# Altium project pdb-25.PrjPcb (part 2 of 3)

## Sheet 18V_Buck.SchDoc
size 259 x 167 mm; SheetNumber: 6; SheetTotal: 15
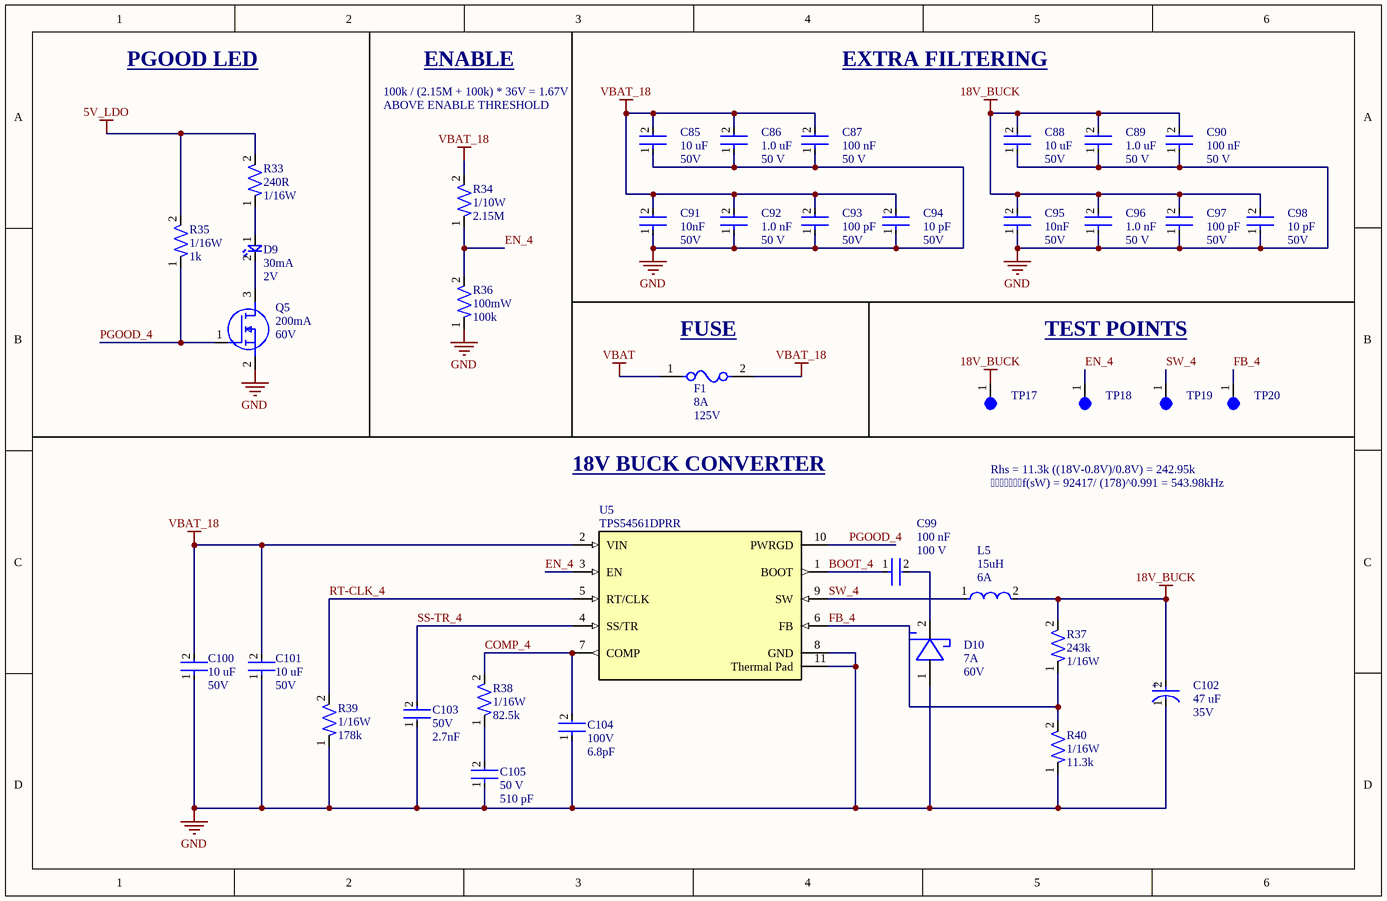
[diagram p5: 18V_Buck.SchDoc]

### Parts
(Parts that share a designator on the sheet are numbered #1, #2 ... from top to bottom, then left to right.)
C85  Voltage: 50V  Capacitance: 10 uF  [CAP-1210]  (hidden comment: CL32B106KBJNNNE)
C86  Voltage: 50 V  Capacitance: 1.0 uF  [CAP-0805]  (hidden comment: CC0805KKX7R9BB105)
C87  Voltage Rating: 50 V  Capacitance: 100 nF  [CAP-0805]  (hidden comment: CC0805KRX7R9BB104)
C88  Voltage: 50V  Capacitance: 10 uF  [CAP-1210]  (hidden comment: CL32B106KBJNNNE)
C89  Voltage: 50 V  Capacitance: 1.0 uF  [CAP-0805]  (hidden comment: CC0805KKX7R9BB105)
C90  Voltage Rating: 50 V  Capacitance: 100 nF  [CAP-0805]  (hidden comment: CC0805KRX7R9BB104)
C91  Voltage: 50V  Capacitance: 10nF  [CAP-0805]  (hidden comment: GRM2195C1H103JA01D)
C92  Voltage: 50 V  Capacitance: 1.0 nF  [CAP-0402]  (hidden comment: CC0402KRX7R9BB102)
C93  Capacitance: 100 pF  Voltage: 50V  [CAP-0402]  (hidden comment: CC0402JRNPO9BN101)
C94  Capacitance: 10 pF  Voltage: 50V  [CAP-0402]  (hidden comment: CC0402JRNPO9BN100)
C95  Voltage: 50V  Capacitance: 10nF  [CAP-0805]  (hidden comment: GRM2195C1H103JA01D)
C96  Voltage: 50 V  Capacitance: 1.0 nF  [CAP-0402]  (hidden comment: CC0402KRX7R9BB102)
C97  Capacitance: 100 pF  Voltage: 50V  [CAP-0402]  (hidden comment: CC0402JRNPO9BN101)
C98  Capacitance: 10 pF  Voltage: 50V  [CAP-0402]  (hidden comment: CC0402JRNPO9BN100)
C99  Capacitance: 100 nF  Voltage: 100 V  [CAP-0603]  (hidden comment: CC0603KRX7R0BB104)
C100  Voltage: 50V  Capacitance: 10 uF  [CAP-1210]  (hidden comment: CL32B106KBJNNNE)
C101  Voltage: 50V  Capacitance: 10 uF  [CAP-1210]  (hidden comment: CL32B106KBJNNNE)
C102  Voltage: 35V  Capacitance: 47 uF  [CAP_EEHZC1V470P]  (hidden comment: EEH-ZC1V470P)
C103  Voltage: 50V  Capacitance: 2.7nF  [CAP-0805]  (hidden comment: GRM2165C1H272JA01D)
C104  Voltage: 100V  Capacitance: 6.8pF  [CAP-0603]  (hidden comment: CC0603CRNPO0BN6R8)
C105  Voltage: 50 V  Capacitance: 510 pF  [CAP-0402]  (hidden comment: 0402N511J500CT)
D9  Forward Current: 30mA  Forward Voltage: 2V  [LED-0603]  (hidden comment: BL-HKC36G-AV-TRB)
D10  Forward Current: 7A  Reverse Voltage (DC): 60V  [DO-POWERDI5]  (hidden comment: PDS760-13)
F1#2  Fuse Current: 8A  Voltage Rating: 125V  [FUSE-0001]  (hidden comment: 01550900M)
L5  Inductance: 15uH  Current Rating: 6A  [IND-15U-0002]  (hidden comment: CSAD1010-150M)
Q5  Continuous Current: 200mA  Voltage: 60V  [IC-SOT23-3]  (hidden comment: T2N7002AK,LM)
R33  Resistance: 240R  Power: 1/16W  [RES-0402]  (hidden comment: RC0402FR-07240RL)
R34  Power: 1/10W  Resistance: 2.15M  [RES-0603]  (hidden comment: RC0603FR-072M15L)
R35  Power: 1/16W  Resistance: 1k  [RES-0402]  (hidden comment: RC0402FR-071KL)
R36  Power: 100mW  Resistance: 100k  [RES-0603]  (hidden comment: RC0603FR-07100KL)
R37  Resistance: 243k  Power: 1/16W  [RES-0402]  (hidden comment: RC0402FR-07243KL)
R38  Power: 1/16W  Resistance: 82.5k  [RES-0402]  (hidden comment: RC0402FR-0782K5L)
R39  Power: 1/16W  Resistance: 178k  [RES-0402]  (hidden comment: RTT021783FTH)
R40  Power: 1/16W  Resistance: 11.3k  [RES-0402]  (hidden comment: RC0402FR-0711K3L)
TP17  5003  [TEST-POINT-0001]  (value not drawn)
TP18  5003  [TEST-POINT-0001]  (value not drawn)
TP19  5003  [TEST-POINT-0001]  (value not drawn)
TP20  5003  [TEST-POINT-0001]  (value not drawn)
U5  TPS54561DPRR  [IC-10WSON]

### Nets
5V_LDO: R33.2 R35.2
18V_BUCK: C88.2 C89.2 C90.2 C95.2 C96.2 C97.2 C98.2 C102.2(A) L5.2 R37.2 TP17.1
GND: C85.1 C86.1 C87.1 C88.1 C89.1 C90.1 C91.1 C92.1 C93.1 C94.1 C95.1 C96.1 C97.1 C98.1 C100.1 C101.1 C102.1(C) C103.1 C104.1 C105.1 D10.1(CATHODE) Q5.2(S) R36.1 R39.1 R40.1 U5.8(GND) U5.11(Thermal_Pad)
VBAT: F1#2.1
VBAT_18: C85.2 C86.2 C87.2 C91.2 C92.2 C93.2 C94.2 C100.2 C101.2 F1#2.2 R34.2 U5.2(VIN)
BOOT_4: C99.1 U5.1(BOOT)
COMP_4: C104.2 R38.2 U5.7(COMP)
EN_4: R34.1 R36.2 TP18.1 U5.3(EN)
FB_4: R37.1 R40.2 TP20.1 U5.6(FB)
PGOOD_4: Q5.1(G) R35.1 U5.10(PWRGD)
RT-CLK_4: R39.2 U5.5(RT/CLK)
SS-TR_4: C103.2 U5.4(SS/TR)
SW_4: L5.1 TP19.1 U5.9(SW)
NetC99_2: C99.2 D10.2(ANODE)
NetC105_2: C105.2 R38.1
NetD9_1: D9.1 R33.1
NetD9_2: D9.2 Q5.3(D)

### Notes on the sheet
- PGOOD LED
- 100k / (2.15M + 100k) * 36V = 1.67V
- ABOVE ENABLE THRESHOLD
- ENABLE
- EXTRA FILTERING
- (near F1#2) FUSE
- TEST POINTS
- 18V BUCK CONVERTER
- Rhs = 11.3k ((18V-0.8V)/0.8V) = 242.95k
- f(sW) = 92417/ (178)^0.991 = 543.98kHz
- (in symbol CAP-47U-0003) +

### Library data of the parts
C85 C88 C100 C101 = CAP-10U-0002: CAP CER 10UF 50V X7R 1210; Device Class: Ceramic; Size: 1210; ComponentLink1Description: Datasheet; ComponentLink1URL: https://mm.digikey.com/Volume0/opasdata/d220001/medias/docus/41/CL32B106KBJNNNE_Spec.pdf
C86 C89 = CAP-1U-0001: CAP CER 1UF 50V X7R 0805; ComponentLink2URL: https://www.yageo.com/upload/media/product/productsearch/datasheet/mlcc/UPY-GPHC_X7R_6.3V-to-250V_24.pdf; ComponentLink2Description: Datasheet; Device Class: Ceramic; Size: 0805
C87 C90 = CAP-0.1U-0002: CAP CER 0.1UF 50V X7R 0805; ComponentLink2Description: Datasheet; ComponentLink2URL: https://www.yageo.com/upload/media/product/productsearch/datasheet/mlcc/UPY-GPHC_X7R_6.3V-to-250V_24.pdf; Device Class: Ceramic; Size: 0805
C91 C95 = CAP-10N-0001: CAP CER 10000PF 50V C0G/NP0 0805; Device Class: Ceramic; Size: 0805; ComponentLink1Description: Datasheet; ComponentLink1URL: https://search.murata.co.jp/Ceramy/image/img/A01X/G101/ENG/GRM2195C1H103JA01-01.pdf
C92 C96 = CAP-1N-0001: CAP CER 1000PF 50V X7R 0402; ComponentLink2Description: Datasheet; ComponentLink2URL: http://www.yageo.com/documents/recent/UPY-GP_NP0_16V-to-50V_16.pdf; Device Class: Ceramic; Size: 0402
C93 C97 = CAP-100P-0001: CAP CER 100PF 50V C0G/NPO 0402; Device Class: Ceramic; Size: 0402; ComponentLink1Description: Datasheet; ComponentLink1URL: https://www.yageo.com/upload/media/product/productsearch/datasheet/mlcc/UPY-GP_NP0_16V-to-50V_18.pdf
C94 C98 = CAP-10P-0001: CAP CER 10PF 50V C0G/NPO 0402; Device Class: Ceramic; Size: 0402; ComponentLink1Description: Datasheet; ComponentLink1URL: https://www.yageo.com/upload/media/product/productsearch/datasheet/mlcc/UPY-GP_NP0_16V-to-50V_18.pdf
C99 = CAP-100N-0001: CAP CER 0.1UF 100V X7R 0603; Device Class: Ceramic; Size: 0603; ComponentLink1Description: Datasheet; ComponentLink1URL: https://www.yageo.com/upload/media/product/app/datasheet/mlcc/upy-np0x7r_mv_100-to-630v.pdf
C102 = CAP-47U-0003: 47 µF 35 V Aluminum - Polymer Capacitors Radial, Can - SMD 60mOhm 4000 Hrs @ 125°C; Device Class: Electrolytic
C103 = CAP-2.7N-0001: CAP CER 2700PF 50V C0G/NP0 0805; ComponentLink1Description: Datasheet; ComponentLink1URL: https://search.murata.co.jp/Ceramy/image/img/A01X/G101/ENG/GRM2165C1H272JA01-01.pdf; Device Class: Ceramic; Size: 0805
C104 = CAP-6.8P-0001: CAP CER 6.8PF 100V C0G/NPO 0603; Device Class: Ceramic; ComponentLink1Description: Datasheet; ComponentLink1URL: https://www.yageo.com/upload/media/product/productsearch/datasheet/mlcc/UPY-GPHC_X7R_6.3V-to-250V_24.pdf; Size: 0603
C105 = CAP-510P-0001: CAP CER 510PF 50V C0G/NP0 0402; ComponentLink2Description: Datasheet; ComponentLink2URL: https://www.mouser.com/ProductDetail/Walsin/0402N511J500CT?qs=u16ybLDytRbq33ukPPRl4A%3D%3D&srsltid=AfmBOoq1-HCbTRqPV3GtwyI6lHLBf095DSA3Qg1Qkiix4a-obr82TmJ6; Device Class: Ceramic; Size: 0402
D9 = LED-0001: LED YELLOW CLEAR 0603 SMD; ComponentLink1Description: Datasheet; ComponentLink1URL: https://www.americanbrightled.com/pdffiles/led-components/smt/BL-HKC36G-AV-TRB.pdf
D10 = DIO-SCHOTTKY-0001: DIODE SCHOTTKY 60V 7A POWERDI5; ComponentLink1Description: Datasheet; ComponentLink1URL: https://www.diodes.com/assets/Datasheets/PDS760.pdf
F1#2 = FUSE-0001: FUSE BLOK CARTRIDGE 125V 10A SMD; ComponentLink2Description: Datasheet; ComponentLink2URL: https://www.littelfuse.com/~/media/electronics/datasheets/fuses/littelfuse_fuse_154_154t_154l_154tl_datasheet.pdf.pdf
L5 = IND-15U-0002-NoJLC: SMD MOLDING POWER CHOKE; ComponentLink1Description: Datasheet; ComponentLink1URL: https://www.digikey.com/en/products/detail/codaca/CSAD1010-150M/16633512?s=N4IgjCBcoBwAxVAYygMwIYBsDOBTANCAPZQDaIALHAExwDMEAuoQA4AuUIAymwE4CWAOwDmIAL6Ew1MAE5EIFJAw4CxMiGoy6AdmoUQhajGqa6BjTDp6zhywFY4c23UtOLFbVXPVtYK3e9dODsbdwA2OxgQZhB2Th4BEXFJTQhoBTQsPEISSHITS0do1g5Ibj4hUQkNOBhteTiygFVBfjYAeVQAWVx0bABXXlxzfs4AVoAJcwBbIU4wAMJp9AAPeYDq2hgo9MaQFrbOnr7B4cJRsoBBGbmyuwA6DcIAWmp5RT5%2B1VzyAMYxAFAA
Q5 = NMOS-200MA-0001: MOSFET N-CH 60V 200MA SOT23; ComponentLink1Description: Datasheet; ComponentLink1URL: https://toshiba.semicon-storage.com/info/T2N7002AK_datasheet_en_20150401.pdf?did=29712&prodName=T2N7002AK
R33 = RES-240-0001: 240R 0.063W 1% 0402 (1005 Metric)  SMD; Tolerance: 1%; Size: 0402; ComponentLink1Description: Datasheet; ComponentLink1URL: https://www.yageo.com/upload/media/product/products/datasheet/rchip/PYu-RC_Group_51_RoHS_L_12.pdf
R34 = RES-2.15M-0001: RES SMD 2.15M OHM 1% 1/10W 0603; Tolerance: 1%; Size: 0603; ComponentLink1Description: Datasheet; ComponentLink1URL: https://www.yageo.com/upload/media/product/products/datasheet/rchip/PYu-RC_Group_51_RoHS_L_12.pdf
R35 = RES-1k-0001: RES 1K OHM 1% 1/16W 0402; Tolerance: 1%; Size: 0402; ComponentLink1Description: Datasheet; ComponentLink1URL: https://www.yageo.com/upload/media/product/products/datasheet/rchip/PYu-RC_Group_51_RoHS_L_12.pdf
R36 = RES-100k-0001: RES SMD 100K OHM 1% 1/10W 0603; Tolerance: 1%; Size: 0603; ComponentLink1Description: Datasheet; ComponentLink1URL: https://www.yageo.com/upload/media/product/products/datasheet/rchip/PYu-RC_Group_51_RoHS_L_12.pdf
R37 = RES-243k-0001: 243 kOhms ±1% 0.063W, 1/16W Chip Resistor 0402 (1005 Metric) Moisture Resistant Thick Film; Tolerance: 1%; Size: 0402; ComponentLink1Description: Datasheet; ComponentLink1URL: https://www.yageo.com/upload/media/product/products/datasheet/rchip/PYu-RC_Group_51_RoHS_L_12.pdf
R38 = RES-82.5k-0001: 82.5 kOhms ±1% 0.063W, 1/16W Chip Resistor 0402 (1005 Metric) Moisture Resistant Thick Film; Tolerance: 1%; Size: 0603; ComponentLink1Description: Datasheet; ComponentLink1URL: https://www.lcsc.com/datasheet/lcsc_datasheet_2304140030_YAGEO-RC0603FR-0712KL_C114659.pdf
R39 = RES-178k-0001_1: 62.5mW Thick Film Resistors 50V ±100ppm/℃ ±1% 178kΩ 0402 Chip Resistor - Surface Mount ROHS; Tolerance: 1%; Size: 0402; ComponentLink1Description: Datasheet; ComponentLink1URL: https://www.lcsc.com/datasheet/lcsc_datasheet_2304140030_RALEC-RTT021783FTH_C102842.pdf
R40 = RES-11.3k-0001: 11.3 kOhms ±1% 0.063W, 1/16W Chip Resistor 0402 (1005 Metric) Moisture Resistant Thick Film; Tolerance: 1%; Size: 0603; ComponentLink1Description: Datasheet; ComponentLink1URL: https://www.yageo.com/upload/media/product/products/datasheet/rchip/PYu-RC_Group_51_RoHS_L_12.pdf
TP17-TP20 = TEST-POINT-0001: Oranange PC Test Point, Miniature Phoisphor Bronze Silver Plating Through Hole Mounting Type
U5 = IC-BUCK-0001: IC REG BUCK ADJ 5A 10WSON; ComponentLink1Description: Datasheet; ComponentLink1URL: https://www.ti.com/general/docs/suppproductinfo.tsp?distId=10&gotoUrl=https%3A%2F%2Fwww.ti.com%2Flit%2Fgpn%2Ftps54561

## Sheet 5V_Buck.SchDoc
size 259 x 167 mm; SheetNumber: 7; SheetTotal: 15
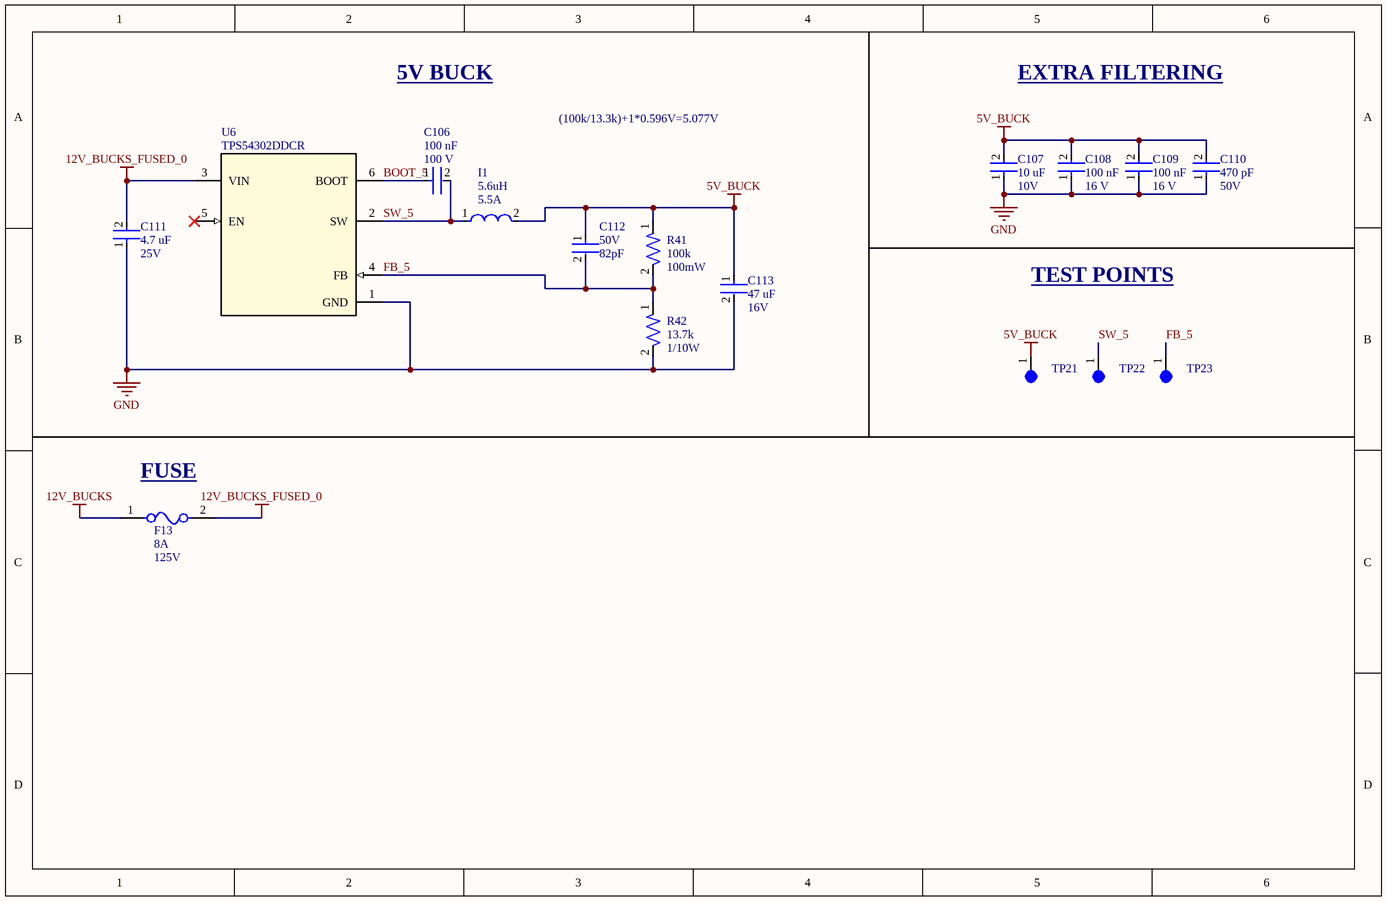
[diagram p6: 5V_Buck.SchDoc]

### Parts
C106  Capacitance: 100 nF  Voltage: 100 V  [CAP-0603]  (hidden comment: CC0603KRX7R0BB104)
C107  Voltage: 10V  Capacitance: 10 uF  [CAP-0603]  (hidden comment: CC0603KRX5R6BB106)
C108  Voltage Rating: 16 V  Capacitance: 100 nF  [CAP-0402]  (hidden comment: CC0402KRX7R7BB104)
C109  Voltage Rating: 16 V  Capacitance: 100 nF  [CAP-0402]  (hidden comment: CC0402KRX7R7BB104)
C110  Voltage: 50V  Capacitance: 470 pF  [CAP-0805]  (hidden comment: CC0805JRNPO9BN471)
C111  Capacitance: 4.7 uF  Voltage: 25V  [CAP-0603]  (hidden comment: CC0603KRX5R8BB475)
C112  Voltage: 50V  Capacitance: 82pF  [CAP-0805]  (hidden comment: CC0805JRNPO9BN820)
C113  Capacitance: 47 uF  Voltage: 16V  [CAP-1210]  (hidden comment: GRM32ER61C476KE15L)
F13  Fuse Current: 8A  Voltage Rating: 125V  [FUSE-0001]  (hidden comment: 01550900M)
I1  Saturation Current: 5.5A  Inductance: 5.6uH  [IND_SRP6540-5R6M]  (hidden comment: SRP6540-5R6M)
R41  Power: 100mW  Resistance: 100k  [RES-0603]  (hidden comment: RC0603FR-07100KL)
R42  Power: 1/10W  Resistance: 13.7k  [RES-0603]  (hidden comment: RC0603FR-0713K7L)
TP21  5003  [TEST-POINT-0001]  (value not drawn)
TP22  5003  [TEST-POINT-0001]  (value not drawn)
TP23  5003  [TEST-POINT-0001]  (value not drawn)
U6  TPS54302DDCR  [IC-SOT-23-6]

### Nets
5V_BUCK: C107.2 C108.2 C109.2 C110.2 C112.1 C113.1 I1.2 R41.1 TP21.1
12V_BUCKS: F13.1
12V_BUCKS_FUSED_0: C111.2 F13.2 U6.3(VIN)
GND: C107.1 C108.1 C109.1 C110.1 C111.1 C113.2 R42.2 U6.1(GND)
BOOT_5: C106.1 U6.6(BOOT)
FB_5: C112.2 R41.2 R42.1 TP23.1 U6.4(FB)
SW_5: C106.2 I1.1 TP22.1 U6.2(SW)

Not connected (* = marked no-connect by the designer): U6 5(EN)*

### Notes on the sheet
- 5V BUCK
- EXTRA FILTERING
- (100k/13.3k)+1*0.596V=5.077V
- TEST POINTS
- (near F13) FUSE

### Library data of the parts
C106 = CAP-100N-0001: CAP CER 0.1UF 100V X7R 0603; Device Class: Ceramic; Size: 0603; ComponentLink1Description: Datasheet; ComponentLink1URL: https://www.yageo.com/upload/media/product/app/datasheet/mlcc/upy-np0x7r_mv_100-to-630v.pdf
C107 = CAP-10U-0001: CAP CER 10UF 10V X5R 0603; ComponentLink1Description: Datasheet; ComponentLink1URL: https://www.yageo.com/upload/media/product/app/datasheet/mlcc/upy-gphc_x5r_4v-to-50v.pdf; Device Class: Ceramic; Size: 0603
C108 C109 = CAP-0.1U-0001: CAP CER 0.1UF 16V X7R 0402; ComponentLink2Description: Datasheet; ComponentLink2URL: https://www.yageo.com/upload/media/product/productsearch/datasheet/mlcc/UPY-GPHC_X7R_6.3V-to-250V_24.pdf; Device Class: Ceramic; Size: 0402
C110 = CAP-470P-0001: CAP CER 470PF 50V C0G/NPO 0805; Device Class: Ceramic; Size: 0805; ComponentLink1Description: Datasheet; ComponentLink1URL: https://www.yageo.com/upload/media/product/productsearch/datasheet/mlcc/UPY-GP_NP0_16V-to-50V_18.pdf
C111 = CAP-4.7U-0001: CAP CER 4.7UF 25V X5R 0603; Device Class: Ceramic; Size: 0603
C112 = CAP-82P-0001: 82 pF ±5% 50V Ceramic Capacitor C0G, NP0 0805 (2012 Metric)
C113 = CAP-47U-0002: CAP CER 47UF 16V X5R 1210; Device Class: Ceramic; Size: 1210; ComponentLink1Description: Datasheet; ComponentLink1URL: https://search.murata.co.jp/Ceramy/image/img/A01X/G101/ENG/GRM32ER61C476KE15-01.pdf
F13 = FUSE-0001: FUSE BLOK CARTRIDGE 125V 10A SMD; ComponentLink2Description: Datasheet; ComponentLink2URL: https://www.littelfuse.com/~/media/electronics/datasheets/fuses/littelfuse_fuse_154_154t_154l_154tl_datasheet.pdf.pdf
I1 = IND-5.6U-0002: FIXED IND 5.6UH 5.5A 38 MOHM SMD
R41 = RES-100k-0001: RES SMD 100K OHM 1% 1/10W 0603; Tolerance: 1%; Size: 0603; ComponentLink1Description: Datasheet; ComponentLink1URL: https://www.yageo.com/upload/media/product/products/datasheet/rchip/PYu-RC_Group_51_RoHS_L_12.pdf
R42 = RES-13.7K-0001: RES 13.7K OHM 1% 1/10W 0603
TP21-TP23 = TEST-POINT-0001: as TP17 on sheet 18V_Buck
U6 = IC-BUCK-0004: IC REG BUCK ADJ 3A SOT23

## Sheet 12V_Buck_For_LDOs.SchDoc
size 259 x 167 mm; SheetNumber: 8; SheetTotal: 15
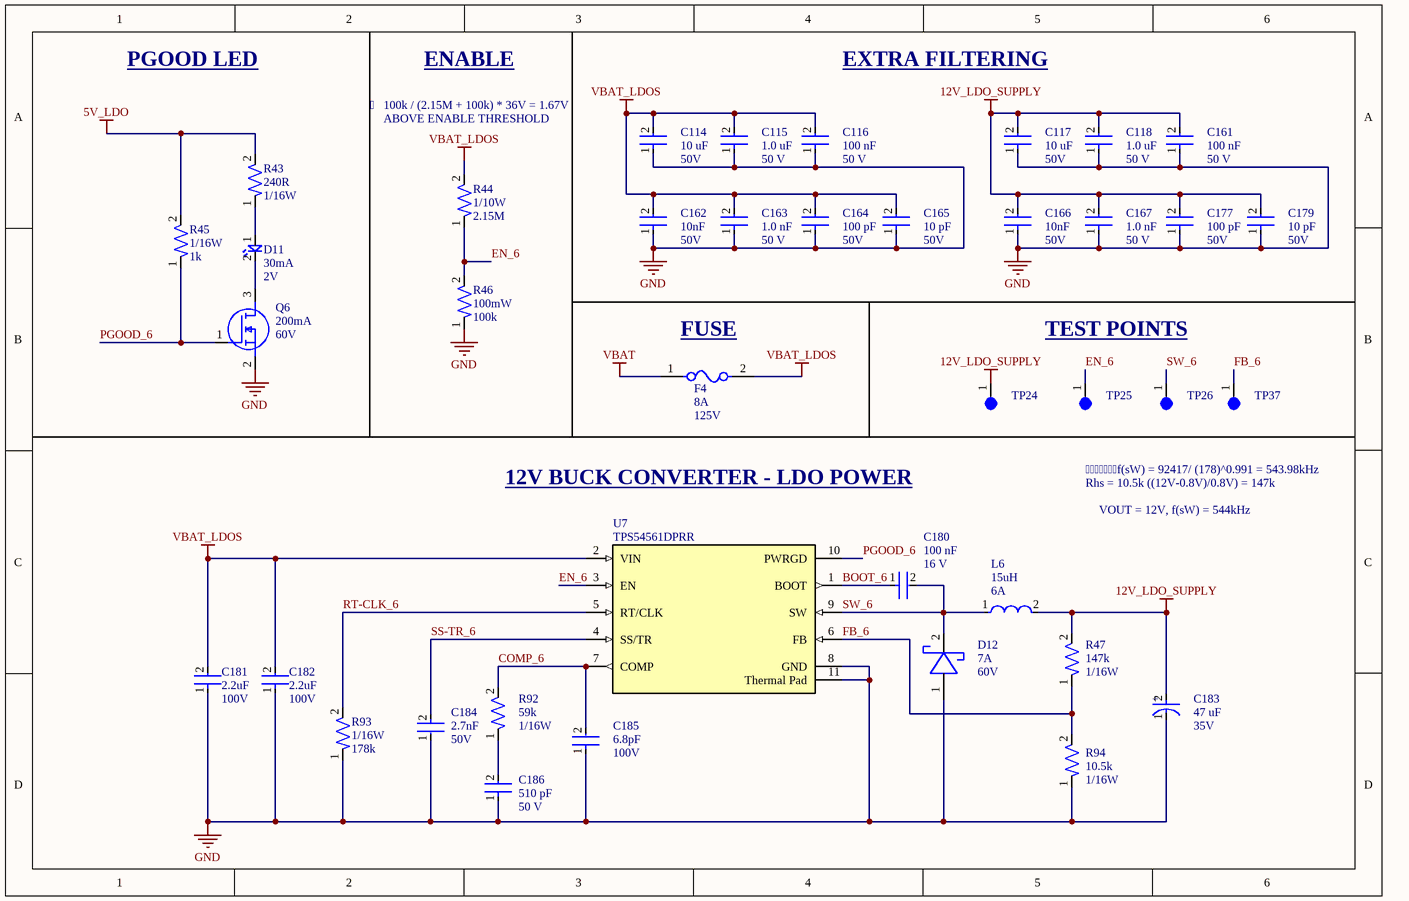
[diagram p7: 12V_Buck_For_LDOs.SchDoc]

### Parts
C114  Voltage: 50V  Capacitance: 10 uF  [CAP-1210]  (hidden comment: CL32B106KBJNNNE)
C115  Voltage: 50 V  Capacitance: 1.0 uF  [CAP-0805]  (hidden comment: CC0805KKX7R9BB105)
C116  Voltage Rating: 50 V  Capacitance: 100 nF  [CAP-0805]  (hidden comment: CC0805KRX7R9BB104)
C117  Voltage: 50V  Capacitance: 10 uF  [CAP-1210]  (hidden comment: CL32B106KBJNNNE)
C118  Voltage: 50 V  Capacitance: 1.0 uF  [CAP-0805]  (hidden comment: CC0805KKX7R9BB105)
C161  Voltage Rating: 50 V  Capacitance: 100 nF  [CAP-0805]  (hidden comment: CC0805KRX7R9BB104)
C162  Voltage: 50V  Capacitance: 10nF  [CAP-0805]  (hidden comment: GRM2195C1H103JA01D)
C163  Voltage: 50 V  Capacitance: 1.0 nF  [CAP-0402]  (hidden comment: CC0402KRX7R9BB102)
C164  Capacitance: 100 pF  Voltage: 50V  [CAP-0402]  (hidden comment: CC0402JRNPO9BN101)
C165  Capacitance: 10 pF  Voltage: 50V  [CAP-0402]  (hidden comment: CC0402JRNPO9BN100)
C166  Voltage: 50V  Capacitance: 10nF  [CAP-0805]  (hidden comment: GRM2195C1H103JA01D)
C167  Voltage: 50 V  Capacitance: 1.0 nF  [CAP-0402]  (hidden comment: CC0402KRX7R9BB102)
C177  Capacitance: 100 pF  Voltage: 50V  [CAP-0402]  (hidden comment: CC0402JRNPO9BN101)
C179  Capacitance: 10 pF  Voltage: 50V  [CAP-0402]  (hidden comment: CC0402JRNPO9BN100)
C180  Voltage Rating: 16 V  Capacitance: 100 nF  [CAP-0402]  (hidden comment: CC0402KRX7R7BB104)
C181  Capacitance: 2.2uF  Voltage: 100V  [CAP-1206]  (hidden comment: CC1206KKX7R0BB225)
C182  Capacitance: 2.2uF  Voltage: 100V  [CAP-1206]  (hidden comment: CC1206KKX7R0BB225)
C183  Voltage: 35V  Capacitance: 47 uF  [CAP_EEHZC1V470P]  (hidden comment: EEH-ZC1V470P)
C184  Voltage: 50V  Capacitance: 2.7nF  [CAP-0805]  (hidden comment: GRM2165C1H272JA01D)
C185  Voltage: 100V  Capacitance: 6.8pF  [CAP-0603]  (hidden comment: CC0603CRNPO0BN6R8)
C186  Voltage: 50 V  Capacitance: 510 pF  [CAP-0402]  (hidden comment: 0402N511J500CT)
D11  Forward Current: 30mA  Forward Voltage: 2V  [LED-0603]  (hidden comment: BL-HKC36G-AV-TRB)
D12  Forward Current: 7A  Reverse Voltage (DC): 60V  [DO-POWERDI5]  (hidden comment: PDS760-13)
F4  Fuse Current: 8A  Voltage Rating: 125V  [FUSE-0001]  (hidden comment: 01550900M)
L6  Inductance: 15uH  Current Rating: 6A  [IND-15U-0002]  (hidden comment: CSAD1010-150M)
Q6  Continuous Current: 200mA  Voltage: 60V  [IC-SOT23-3]  (hidden comment: T2N7002AK,LM)
R43  Resistance: 240R  Power: 1/16W  [RES-0402]  (hidden comment: RC0402FR-07240RL)
R44  Power: 1/10W  Resistance: 2.15M  [RES-0603]  (hidden comment: RC0603FR-072M15L)
R45  Power: 1/16W  Resistance: 1k  [RES-0402]  (hidden comment: RC0402FR-071KL)
R46  Power: 100mW  Resistance: 100k  [RES-0603]  (hidden comment: RC0603FR-07100KL)
R47  Power: 1/16W  Resistance: 147k  [RES-0402]  (hidden comment: RC0402FR-07147KL)
R92  Power: 1/16W  Resistance: 59k  [RES-0402]  (hidden comment: RC0402FR-0759KL)
R93  Power: 1/16W  Resistance: 178k  [RES-0402]  (hidden comment: RTT021783FTH)
R94  Power: 1/16W  Resistance: 10.5k  [RES-0402]  (hidden comment: RC0402FR-0710K5L)
TP24  5003  [TEST-POINT-0001]  (value not drawn)
TP25  5003  [TEST-POINT-0001]  (value not drawn)
TP26  5003  [TEST-POINT-0001]  (value not drawn)
TP37  5003  [TEST-POINT-0001]  (value not drawn)
U7  TPS54561DPRR  [IC-10WSON]

### Nets
5V_LDO: R43.2 R45.2
12V_LDO_SUPPLY: C117.2 C118.2 C161.2 C166.2 C167.2 C177.2 C179.2 C183.2(A) L6.2 R47.2 TP24.1
GND: C114.1 C115.1 C116.1 C117.1 C118.1 C161.1 C162.1 C163.1 C164.1 C165.1 C166.1 C167.1 C177.1 C179.1 C181.1 C182.1 C183.1(C) C184.1 C185.1 C186.1 D12.1(CATHODE) Q6.2(S) R46.1 R93.1 R94.1 U7.8(GND) U7.11(Thermal_Pad)
VBAT: F4.1
VBAT_LDOS: C114.2 C115.2 C116.2 C162.2 C163.2 C164.2 C165.2 C181.2 C182.2 F4.2 R44.2 U7.2(VIN)
BOOT_6: C180.1 U7.1(BOOT)
COMP_6: C185.2 R92.2 U7.7(COMP)
EN_6: R44.1 R46.2 TP25.1 U7.3(EN)
FB_6: R47.1 R94.2 TP37.1 U7.6(FB)
PGOOD_6: Q6.1(G) R45.1 U7.10(PWRGD)
RT-CLK_6: R93.2 U7.5(RT/CLK)
SS-TR_6: C184.2 U7.4(SS/TR)
SW_6: C180.2 D12.2(ANODE) L6.1 TP26.1 U7.9(SW)
NetC186_2: C186.2 R92.1
NetD11_1: D11.1 R43.1
NetD11_2: D11.2 Q6.3(D)

### Notes on the sheet
- PGOOD LED
- 
- 100k / (2.15M + 100k) * 36V = 1.67V
- ENABLE
- EXTRA FILTERING
- ABOVE ENABLE THRESHOLD
- (near F4) FUSE
- TEST POINTS
- 12V BUCK CONVERTER - LDO POWER
- Rhs = 10.5k ((12V-0.8V)/0.8V) = 147k
- f(sW) = 92417/ (178)^0.991 = 543.98kHz
- VOUT = 12V, f(sW) = 544kHz
- (in symbol CAP-47U-0003) +

### Library data of the parts
C114 C117 = CAP-10U-0002: CAP CER 10UF 50V X7R 1210; Device Class: Ceramic; Size: 1210; ComponentLink1Description: Datasheet; ComponentLink1URL: https://mm.digikey.com/Volume0/opasdata/d220001/medias/docus/41/CL32B106KBJNNNE_Spec.pdf
C115 C118 = CAP-1U-0001: CAP CER 1UF 50V X7R 0805; ComponentLink2URL: https://www.yageo.com/upload/media/product/productsearch/datasheet/mlcc/UPY-GPHC_X7R_6.3V-to-250V_24.pdf; ComponentLink2Description: Datasheet; Device Class: Ceramic; Size: 0805
C116 C161 = CAP-0.1U-0002: CAP CER 0.1UF 50V X7R 0805; ComponentLink2Description: Datasheet; ComponentLink2URL: https://www.yageo.com/upload/media/product/productsearch/datasheet/mlcc/UPY-GPHC_X7R_6.3V-to-250V_24.pdf; Device Class: Ceramic; Size: 0805
C162 C166 = CAP-10N-0001: CAP CER 10000PF 50V C0G/NP0 0805; Device Class: Ceramic; Size: 0805; ComponentLink1Description: Datasheet; ComponentLink1URL: https://search.murata.co.jp/Ceramy/image/img/A01X/G101/ENG/GRM2195C1H103JA01-01.pdf
C163 C167 = CAP-1N-0001: CAP CER 1000PF 50V X7R 0402; ComponentLink2Description: Datasheet; ComponentLink2URL: http://www.yageo.com/documents/recent/UPY-GP_NP0_16V-to-50V_16.pdf; Device Class: Ceramic; Size: 0402
C164 C177 = CAP-100P-0001: CAP CER 100PF 50V C0G/NPO 0402; Device Class: Ceramic; Size: 0402; ComponentLink1Description: Datasheet; ComponentLink1URL: https://www.yageo.com/upload/media/product/productsearch/datasheet/mlcc/UPY-GP_NP0_16V-to-50V_18.pdf
C165 C179 = CAP-10P-0001: CAP CER 10PF 50V C0G/NPO 0402; Device Class: Ceramic; Size: 0402; ComponentLink1Description: Datasheet; ComponentLink1URL: https://www.yageo.com/upload/media/product/productsearch/datasheet/mlcc/UPY-GP_NP0_16V-to-50V_18.pdf
C180 = CAP-0.1U-0001: CAP CER 0.1UF 16V X7R 0402; ComponentLink2Description: Datasheet; ComponentLink2URL: https://www.yageo.com/upload/media/product/productsearch/datasheet/mlcc/UPY-GPHC_X7R_6.3V-to-250V_24.pdf; Device Class: Ceramic; Size: 0402
C181 C182 = CAP-2.2U-0001: CAP CER 2.2UF 100V X7R 1206; Device Class: Ceramic; Size: 1206; ComponentLink1Description: Datasheet; ComponentLink1URL: https://www.yageo.com/upload/media/product/productsearch/datasheet/mlcc/UPY-GPHC_X7R_6.3V-to-250V_24.pdf
C183 = CAP-47U-0003: as C102 on sheet 18V_Buck; Device Class: Electrolytic
C184 = CAP-2.7N-0001: CAP CER 2700PF 50V C0G/NP0 0805; ComponentLink1Description: Datasheet; ComponentLink1URL: https://search.murata.co.jp/Ceramy/image/img/A01X/G101/ENG/GRM2165C1H272JA01-01.pdf; Device Class: Ceramic; Size: 0805
C185 = CAP-6.8P-0001: CAP CER 6.8PF 100V C0G/NPO 0603; Device Class: Ceramic; ComponentLink1Description: Datasheet; ComponentLink1URL: https://www.yageo.com/upload/media/product/productsearch/datasheet/mlcc/UPY-GPHC_X7R_6.3V-to-250V_24.pdf; Size: 0603
C186 = CAP-510P-0001: CAP CER 510PF 50V C0G/NP0 0402; ComponentLink2Description: Datasheet; ComponentLink2URL: https://www.mouser.com/ProductDetail/Walsin/0402N511J500CT?qs=u16ybLDytRbq33ukPPRl4A%3D%3D&srsltid=AfmBOoq1-HCbTRqPV3GtwyI6lHLBf095DSA3Qg1Qkiix4a-obr82TmJ6; Device Class: Ceramic; Size: 0402
D11 = LED-0001: LED YELLOW CLEAR 0603 SMD; ComponentLink1Description: Datasheet; ComponentLink1URL: https://www.americanbrightled.com/pdffiles/led-components/smt/BL-HKC36G-AV-TRB.pdf
D12 = DIO-SCHOTTKY-0001: DIODE SCHOTTKY 60V 7A POWERDI5; ComponentLink1Description: Datasheet; ComponentLink1URL: https://www.diodes.com/assets/Datasheets/PDS760.pdf
F4 = FUSE-0001: FUSE BLOK CARTRIDGE 125V 10A SMD; ComponentLink2Description: Datasheet; ComponentLink2URL: https://www.littelfuse.com/~/media/electronics/datasheets/fuses/littelfuse_fuse_154_154t_154l_154tl_datasheet.pdf.pdf
L6 = IND-15U-0002-NoJLC: SMD MOLDING POWER CHOKE; ComponentLink1Description: Datasheet; ComponentLink1URL: https://www.digikey.com/en/products/detail/codaca/CSAD1010-150M/16633512?s=N4IgjCBcoBwAxVAYygMwIYBsDOBTANCAPZQDaIALHAExwDMEAuoQA4AuUIAymwE4CWAOwDmIAL6Ew1MAE5EIFJAw4CxMiGoy6AdmoUQhajGqa6BjTDp6zhywFY4c23UtOLFbVXPVtYK3e9dODsbdwA2OxgQZhB2Th4BEXFJTQhoBTQsPEISSHITS0do1g5Ibj4hUQkNOBhteTiygFVBfjYAeVQAWVx0bABXXlxzfs4AVoAJcwBbIU4wAMJp9AAPeYDq2hgo9MaQFrbOnr7B4cJRsoBBGbmyuwA6DcIAWmp5RT5%2B1VzyAMYxAFAA
Q6 = NMOS-200MA-0001: MOSFET N-CH 60V 200MA SOT23; ComponentLink1Description: Datasheet; ComponentLink1URL: https://toshiba.semicon-storage.com/info/T2N7002AK_datasheet_en_20150401.pdf?did=29712&prodName=T2N7002AK
R43 = RES-240-0001: 240R 0.063W 1% 0402 (1005 Metric)  SMD; Tolerance: 1%; Size: 0402; ComponentLink1Description: Datasheet; ComponentLink1URL: https://www.yageo.com/upload/media/product/products/datasheet/rchip/PYu-RC_Group_51_RoHS_L_12.pdf
R44 = RES-2.15M-0001: RES SMD 2.15M OHM 1% 1/10W 0603; Tolerance: 1%; Size: 0603; ComponentLink1Description: Datasheet; ComponentLink1URL: https://www.yageo.com/upload/media/product/products/datasheet/rchip/PYu-RC_Group_51_RoHS_L_12.pdf
R45 = RES-1k-0001: RES 1K OHM 1% 1/16W 0402; Tolerance: 1%; Size: 0402; ComponentLink1Description: Datasheet; ComponentLink1URL: https://www.yageo.com/upload/media/product/products/datasheet/rchip/PYu-RC_Group_51_RoHS_L_12.pdf
R46 = RES-100k-0001: RES SMD 100K OHM 1% 1/10W 0603; Tolerance: 1%; Size: 0603; ComponentLink1Description: Datasheet; ComponentLink1URL: https://www.yageo.com/upload/media/product/products/datasheet/rchip/PYu-RC_Group_51_RoHS_L_12.pdf
R47 = RES-147k-0001: RES 147K OHM 1% 1/16W 0402; Tolerance: 1%; Size: 0402; ComponentLink1Description: Datasheet; ComponentLink1URL: https://www.yageo.com/upload/media/product/products/datasheet/rchip/PYu-RC_Group_51_RoHS_L_12.pdf
R92 = RES-59k-0001: RES 59K OHM 1% 1/16W 0402; Tolerance: 1%; Size: 0402; ComponentLink1Description: Datasheet; ComponentLink1URL: https://www.digikey.com/en/products/detail/yageo/RC0402FR-0759KL/2827634?s=N4IgTCBcDaIEoGEAMAWJYBicC0SDsArAJwDSAMiALoC%2BQA
R93 = RES-178k-0001_1: as R39 on sheet 18V_Buck; Tolerance: 1%; Size: 0402; ComponentLink1Description: Datasheet; ComponentLink1URL: https://www.lcsc.com/datasheet/lcsc_datasheet_2304140030_RALEC-RTT021783FTH_C102842.pdf
R94 = RES-10.5k-0001: RES 10.5K OHM 1% 1/16W 0402; Tolerance: 1%; Size: 0402; ComponentLink1Description: Datasheet; ComponentLink1URL: https://www.yageo.com/upload/media/product/products/datasheet/rchip/PYu-RC_Group_51_RoHS_L_12.pdf
TP24-TP26 TP37 = TEST-POINT-0001: as TP17 on sheet 18V_Buck
U7 = IC-BUCK-0001: IC REG BUCK ADJ 5A 10WSON; ComponentLink1Description: Datasheet; ComponentLink1URL: https://www.ti.com/general/docs/suppproductinfo.tsp?distId=10&gotoUrl=https%3A%2F%2Fwww.ti.com%2Flit%2Fgpn%2Ftps54561

## Sheet 3V3_Buck.SchDoc
size 259 x 167 mm; SheetNumber: 9; SheetTotal: 15
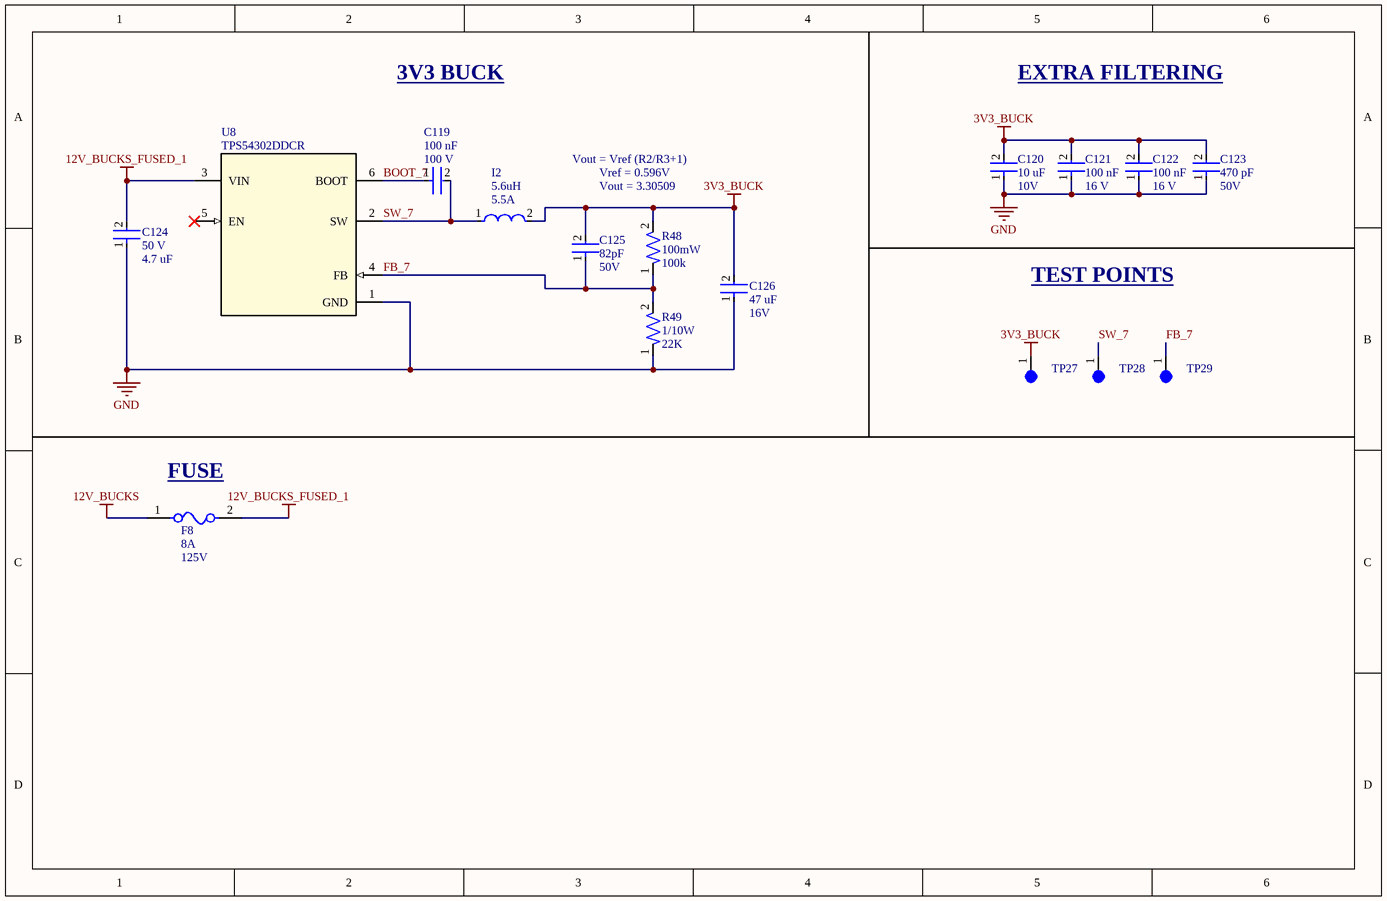
[diagram p8: 3V3_Buck.SchDoc]

### Parts
(Parts that share a designator on the sheet are numbered #1, #2 ... from top to bottom, then left to right.)
C119  Capacitance: 100 nF  Voltage: 100 V  [CAP-0603]  (hidden comment: CC0603KRX7R0BB104)
C120  Voltage: 10V  Capacitance: 10 uF  [CAP-0603]  (hidden comment: CC0603KRX5R6BB106)
C121  Voltage Rating: 16 V  Capacitance: 100 nF  [CAP-0402]  (hidden comment: CC0402KRX7R7BB104)
C122  Voltage Rating: 16 V  Capacitance: 100 nF  [CAP-0402]  (hidden comment: CC0402KRX7R7BB104)
C123  Voltage: 50V  Capacitance: 470 pF  [CAP-0805]  (hidden comment: CC0805JRNPO9BN471)
C124  Voltage: 50 V  Capacitance: 4.7 uF  [CAP-0805]  (hidden comment: CC0805KKX5R9BB475)
C125  Voltage: 50V  Capacitance: 82pF  [CAP-0805]  (hidden comment: CC0805JRNPO9BN820)
C126  Capacitance: 47 uF  Voltage: 16V  [CAP-1210]  (hidden comment: GRM32ER61C476KE15L)
F8#1  Fuse Current: 8A  Voltage Rating: 125V  [FUSE-0001]  (hidden comment: 01550900M)
I2  Saturation Current: 5.5A  Inductance: 5.6uH  [IND_SRP6540-5R6M]  (hidden comment: SRP6540-5R6M)
R48  Power: 100mW  Resistance: 100k  [RES-0603]  (hidden comment: RC0603FR-07100KL)
R49  Power: 1/10W  Resistance: 22K  [RES-0603]  (hidden comment: RC0603FR-0722KL)
TP27  5003  [TEST-POINT-0001]  (value not drawn)
TP28  5003  [TEST-POINT-0001]  (value not drawn)
TP29  5003  [TEST-POINT-0001]  (value not drawn)
U8  TPS54302DDCR  [IC-SOT-23-6]

### Nets
3V3_BUCK: C120.2 C121.2 C122.2 C123.2 C125.2 C126.2 I2.2 R48.2 TP27.1
12V_BUCKS: F8#1.1
12V_BUCKS_FUSED_1: C124.2 F8#1.2 U8.3(VIN)
GND: C120.1 C121.1 C122.1 C123.1 C124.1 C126.1 R49.1 U8.1(GND)
BOOT_7: C119.1 U8.6(BOOT)
FB_7: C125.1 R48.1 R49.2 TP29.1 U8.4(FB)
SW_7: C119.2 I2.1 TP28.1 U8.2(SW)

Not connected (* = marked no-connect by the designer): U8 5(EN)*

### Notes on the sheet
- 3V3 BUCK
- EXTRA FILTERING
- Vout = Vref (R2/R3+1)
- Vref = 0.596V
- Vout = 3.30509
- TEST POINTS
- (near F8#1) FUSE

### Library data of the parts
C119 = CAP-100N-0001: CAP CER 0.1UF 100V X7R 0603; Device Class: Ceramic; Size: 0603; ComponentLink1Description: Datasheet; ComponentLink1URL: https://www.yageo.com/upload/media/product/app/datasheet/mlcc/upy-np0x7r_mv_100-to-630v.pdf
C120 = CAP-10U-0001: CAP CER 10UF 10V X5R 0603; ComponentLink1Description: Datasheet; ComponentLink1URL: https://www.yageo.com/upload/media/product/app/datasheet/mlcc/upy-gphc_x5r_4v-to-50v.pdf; Device Class: Ceramic; Size: 0603
C121 C122 = CAP-0.1U-0001: CAP CER 0.1UF 16V X7R 0402; ComponentLink2Description: Datasheet; ComponentLink2URL: https://www.yageo.com/upload/media/product/productsearch/datasheet/mlcc/UPY-GPHC_X7R_6.3V-to-250V_24.pdf; Device Class: Ceramic; Size: 0402
C123 = CAP-470P-0001: CAP CER 470PF 50V C0G/NPO 0805; Device Class: Ceramic; Size: 0805; ComponentLink1Description: Datasheet; ComponentLink1URL: https://www.yageo.com/upload/media/product/productsearch/datasheet/mlcc/UPY-GP_NP0_16V-to-50V_18.pdf
C124 = CAP-4.7U-0002: CAP CER 4.7UF 50V X5R 0805; ComponentLink2Description: Datasheet; ComponentLink2URL: http://www.yageo.com/documents/recent/UPY-GPHC_Y5V_6.3V-to-50V_8.pdf; Device Class: Ceramic; Size: 0805
C125 = CAP-82P-0001: as C112 on sheet 5V_Buck
C126 = CAP-47U-0002: CAP CER 47UF 16V X5R 1210; Device Class: Ceramic; Size: 1210; ComponentLink1Description: Datasheet; ComponentLink1URL: https://search.murata.co.jp/Ceramy/image/img/A01X/G101/ENG/GRM32ER61C476KE15-01.pdf
F8#1 = FUSE-0001: FUSE BLOK CARTRIDGE 125V 10A SMD; ComponentLink2Description: Datasheet; ComponentLink2URL: https://www.littelfuse.com/~/media/electronics/datasheets/fuses/littelfuse_fuse_154_154t_154l_154tl_datasheet.pdf.pdf
I2 = IND-5.6U-0002: FIXED IND 5.6UH 5.5A 38 MOHM SMD
R48 = RES-100k-0001: RES SMD 100K OHM 1% 1/10W 0603; Tolerance: 1%; Size: 0603; ComponentLink1Description: Datasheet; ComponentLink1URL: https://www.yageo.com/upload/media/product/products/datasheet/rchip/PYu-RC_Group_51_RoHS_L_12.pdf
R49 = RES-22k-0001: 22 kOhms ±1% 0.1W, 1/10W Chip Resistor 0603 (1608 Metric) Moisture Resistant Thick Film; Parameter 1: *
TP27-TP29 = TEST-POINT-0001: as TP17 on sheet 18V_Buck
U8 = IC-BUCK-0004: IC REG BUCK ADJ 3A SOT23

## Sheet LDOs.SchDoc
size 259 x 167 mm; SheetNumber: 10; SheetTotal: 15
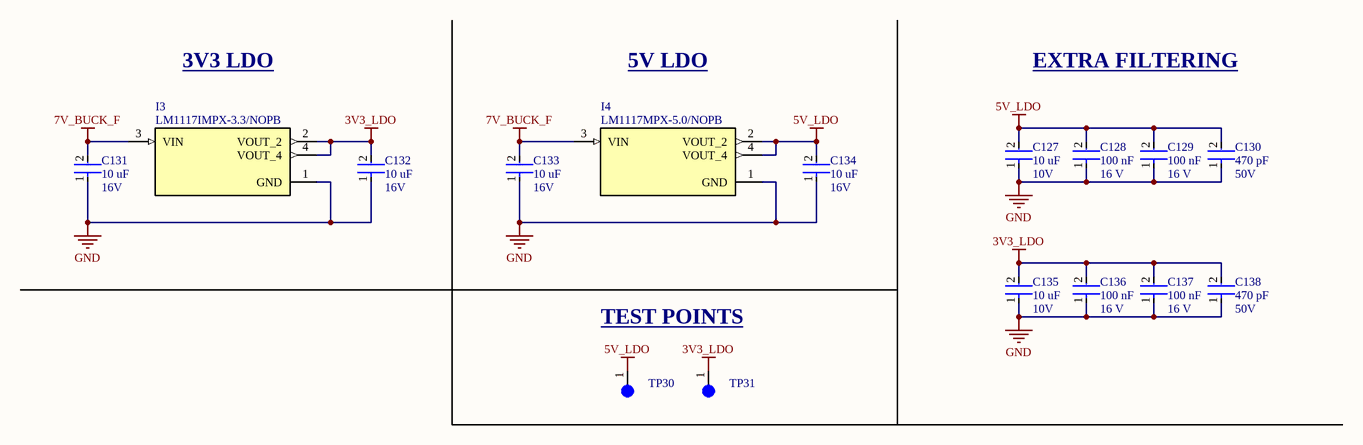
[diagram p9: LDOs.SchDoc]

### Parts
C127  Voltage: 10V  Capacitance: 10 uF  [CAP-0603]  (hidden comment: CC0603KRX5R6BB106)
C128  Voltage Rating: 16 V  Capacitance: 100 nF  [CAP-0402]  (hidden comment: CC0402KRX7R7BB104)
C129  Voltage Rating: 16 V  Capacitance: 100 nF  [CAP-0402]  (hidden comment: CC0402KRX7R7BB104)
C130  Voltage: 50V  Capacitance: 470 pF  [CAP-0805]  (hidden comment: CC0805JRNPO9BN471)
C131  Voltage: 16V  Capacitance: 10 uF  [CAP-1210]  (hidden comment: 293D106X9016A2TE3)
C132  Voltage: 16V  Capacitance: 10 uF  [CAP-1210]  (hidden comment: 293D106X9016A2TE3)
C133  Voltage: 16V  Capacitance: 10 uF  [CAP-1210]  (hidden comment: 293D106X9016A2TE3)
C134  Voltage: 16V  Capacitance: 10 uF  [CAP-1210]  (hidden comment: 293D106X9016A2TE3)
C135  Voltage: 10V  Capacitance: 10 uF  [CAP-0603]  (hidden comment: CC0603KRX5R6BB106)
C136  Voltage Rating: 16 V  Capacitance: 100 nF  [CAP-0402]  (hidden comment: CC0402KRX7R7BB104)
C137  Voltage Rating: 16 V  Capacitance: 100 nF  [CAP-0402]  (hidden comment: CC0402KRX7R7BB104)
C138  Voltage: 50V  Capacitance: 470 pF  [CAP-0805]  (hidden comment: CC0805JRNPO9BN471)
I3  LM1117IMPX-3.3/NOPB  [IC-SOT-223-4]
I4  LM1117MPX-5.0/NOPB  [IC-SOT-223-4]
TP30  5003  [TEST-POINT-0001]  (value not drawn)
TP31  5003  [TEST-POINT-0001]  (value not drawn)

### Nets
3V3_LDO: C132.2 C135.2 C136.2 C137.2 C138.2 I3.2(VOUT_2) I3.4(VOUT_4) TP31.1
5V_LDO: C127.2 C128.2 C129.2 C130.2 C134.2 I4.2(VOUT_2) I4.4(VOUT_4) TP30.1
7V_BUCK_F: C131.2 C133.2 I3.3(VIN) I4.3(VIN)
GND: C127.1 C128.1 C129.1 C130.1 C131.1 C132.1 C133.1 C134.1 C135.1 C136.1 C137.1 C138.1 I3.1(GND) I4.1(GND)

### Notes on the sheet
- 3V3 LDO
- 5V LDO
- EXTRA FILTERING
- TEST POINTS

### Library data of the parts
C127 C135 = CAP-10U-0001: CAP CER 10UF 10V X5R 0603; ComponentLink1Description: Datasheet; ComponentLink1URL: https://www.yageo.com/upload/media/product/app/datasheet/mlcc/upy-gphc_x5r_4v-to-50v.pdf; Device Class: Ceramic; Size: 0603
C128 C129 C136 C137 = CAP-0.1U-0001: CAP CER 0.1UF 16V X7R 0402; ComponentLink2Description: Datasheet; ComponentLink2URL: https://www.yageo.com/upload/media/product/productsearch/datasheet/mlcc/UPY-GPHC_X7R_6.3V-to-250V_24.pdf; Device Class: Ceramic; Size: 0402
C130 C138 = CAP-470P-0001: CAP CER 470PF 50V C0G/NPO 0805; Device Class: Ceramic; Size: 0805; ComponentLink1Description: Datasheet; ComponentLink1URL: https://www.yageo.com/upload/media/product/productsearch/datasheet/mlcc/UPY-GP_NP0_16V-to-50V_18.pdf
C131-C134 = CAP-10U-0003: CAP TANT 10UF 10% 16V 1206; Device Class: Tantalum; Size: 1206; ComponentLink1Description: Datasheet; ComponentLink1URL: https://www.lcsc.com/datasheet/lcsc_datasheet_2304140030_Vishay-Intertech-293D106X9016A2TE3_C110038.pdf
I3 = IC_LDO_3V3_0001: IC REG LIN 3.3V 800MA SOT223-4; ComponentLink1Description: New link; ComponentLink1URL: https://www.ti.com/lit/ds/symlink/lm1117.pdf?HQS=dis-dk-null-digikeymode-dsf-pf-null-wwe&ts=1721700739746
I4 = IC_LDO_5V_0001: IC REG LINEAR 5V 800MA SOT223-4; ComponentLink1Description: Datasheet; ComponentLink1URL: https://www.ti.com/lit/ds/symlink/lm1117.pdf?HQS=dis-dk-null-digikeymode-dsf-pf-null-wwe&ts=1721700739746
TP30 TP31 = TEST-POINT-0001: as TP17 on sheet 18V_Buck

## Sheet CAN_Transceiver.SchDoc
size 259 x 167 mm; SheetNumber: 12; SheetTotal: 15
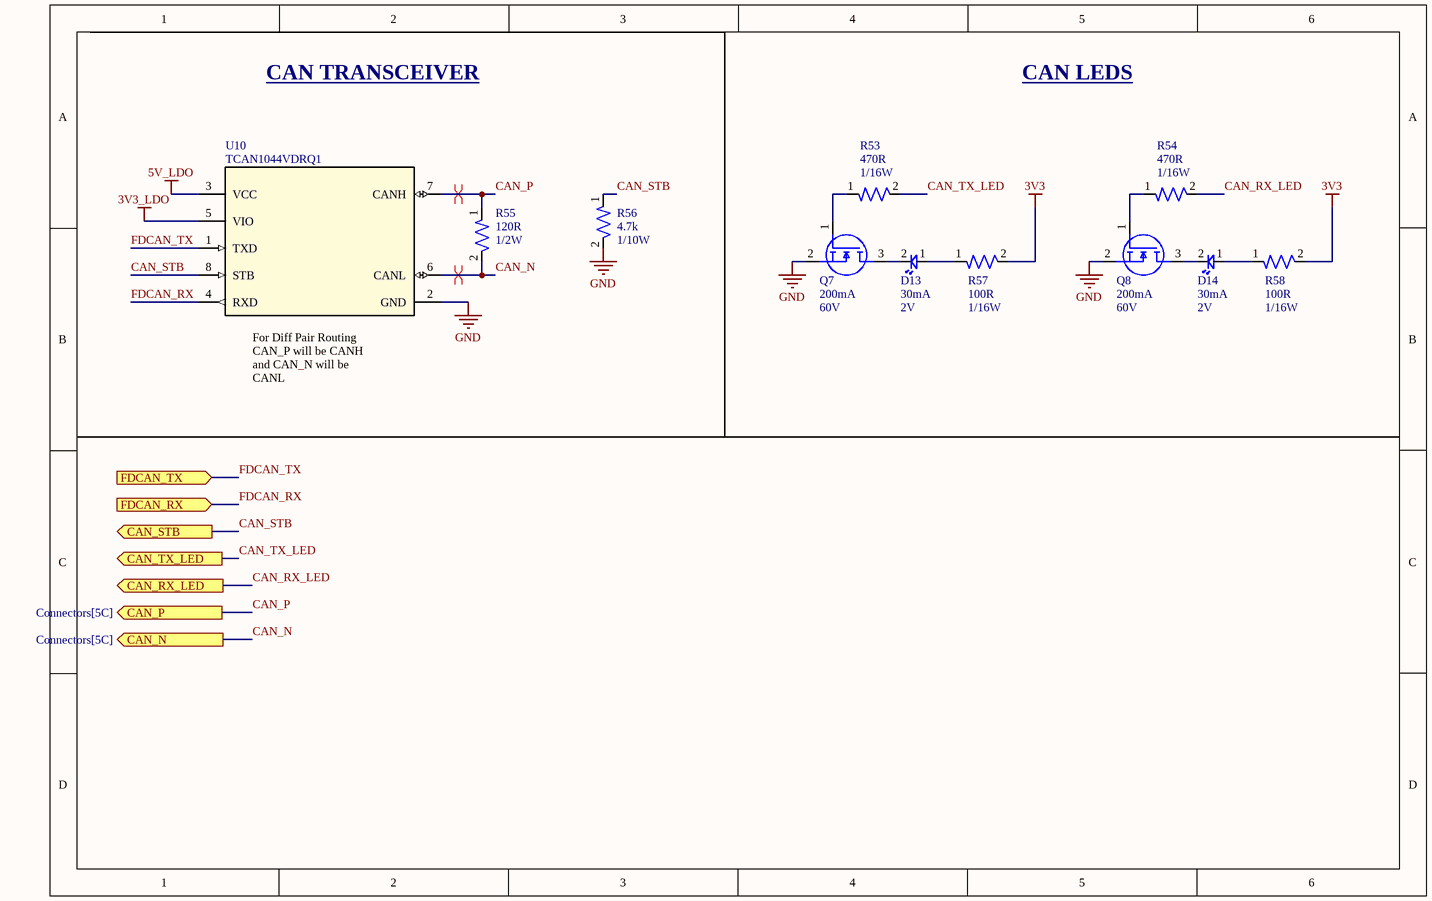
[diagram p10: CAN_Transceiver.SchDoc]

### Parts
D13  Forward Current: 30mA  Forward Voltage: 2V  [LED-0603]  (hidden comment: BL-HKC36G-AV-TRB)
D14  Forward Current: 30mA  Forward Voltage: 2V  [LED-0603]  (hidden comment: BL-HKC36G-AV-TRB)
Q7  Continuous Current: 200mA  Voltage: 60V  [IC-SOT23-3]  (hidden comment: T2N7002AK,LM)
Q8  Continuous Current: 200mA  Voltage: 60V  [IC-SOT23-3]  (hidden comment: T2N7002AK,LM)
R53  Power: 1/16W  Resistance: 470R  [RES-0402]  (hidden comment: RC0402FR-07470RL)
R54  Power: 1/16W  Resistance: 470R  [RES-0402]  (hidden comment: RC0402FR-07470RL)
R55  Power: 1/2W  Resistance: 120R  [RES-1210]  (hidden comment: RC1210FR-07120RL)
R56  Power: 1/10W  Resistance: 4.7k  [RES-0603]  (hidden comment: RC0603FR-074K7L)
R57  Power: 1/16W  Resistance: 100R  [RES-0402]  (hidden comment: RC0402FR-07100RL)
R58  Power: 1/16W  Resistance: 100R  [RES-0402]  (hidden comment: RC0402FR-07100RL)
U10  TCAN1044VDRQ1  [IC-8SOIC]

### Ports
CAN_N (out, see Connectors[5C]), CAN_P (out, see Connectors[5C]), CAN_RX_LED (out, see MCU[6D]), CAN_STB (out, see MCU[6C]), CAN_TX_LED (out, see MCU[6D]), FDCAN_RX (in, see Connectors[5D], MCU[6C]), FDCAN_TX (in, see Connectors[5D], MCU[6C])

### Nets
3V3: R57.2 R58.2
3V3_LDO: U10.5(VIO)
5V_LDO: U10.3(VCC)
GND: Q7.2(S) Q8.2(S) R56.2 U10.2(GND)
CAN_N: R55.2 U10.6(CANL) ; port CAN_N
CAN_P: R55.1 U10.7(CANH) ; port CAN_P
CAN_RX_LED: R54.2 ; port CAN_RX_LED
CAN_STB: R56.1 U10.8(STB) ; port CAN_STB
CAN_TX_LED: R53.2 ; port CAN_TX_LED
FDCAN_RX: U10.4(RXD) ; port FDCAN_RX
FDCAN_TX: U10.1(TXD) ; port FDCAN_TX
NetD13_1: D13.1 R57.1
NetD13_2: D13.2 Q7.3(D)
NetD14_1: D14.1 R58.1
NetD14_2: D14.2 Q8.3(D)
NetQ7_1: Q7.1(G) R53.1
NetQ8_1: Q8.1(G) R54.1

### Layout directives
differential pair: CAN_N, CAN_P

### Notes on the sheet
- CAN TRANSCEIVER
- CAN LEDS
- (near U10) For Diff Pair Routing CAN_P will be CANH and CAN_N will be CANL

### Library data of the parts
D13 D14 = LED-0001: LED YELLOW CLEAR 0603 SMD; ComponentLink1Description: Datasheet; ComponentLink1URL: https://www.americanbrightled.com/pdffiles/led-components/smt/BL-HKC36G-AV-TRB.pdf
Q7 Q8 = NMOS-200MA-0001: MOSFET N-CH 60V 200MA SOT23; ComponentLink1Description: Datasheet; ComponentLink1URL: https://toshiba.semicon-storage.com/info/T2N7002AK_datasheet_en_20150401.pdf?did=29712&prodName=T2N7002AK
R53 R54 = RES-470-0001: RES 470 OHM 1% 1/16W 0402; Tolerance: 1%; Size: 0402; ComponentLink1Description: Datasheet; ComponentLink1URL: https://www.yageo.com/upload/media/product/products/datasheet/rchip/PYu-RC_Group_51_RoHS_L_12.pdf
R55 = RES-120-0001: RES 120 OHM 1% 1/2W 1210; Tolerance: 1%; Size: 1210; ComponentLink1Description: Datasheet; ComponentLink1URL: https://www.yageo.com/upload/media/product/products/datasheet/rchip/PYu-RC_Group_51_RoHS_L_12.pdf
R56 = RES-4.7k-0001: RES 4.7K OHM 1% 1/10W 0603; Tolerance: 1%; Size: 0603; ComponentLink1Description: Datasheet; ComponentLink1URL: https://www.yageo.com/upload/media/product/products/datasheet/rchip/PYu-RC_Group_51_RoHS_L_12.pdf
R57 R58 = RES-100-0001: RES 100 OHM 1% 1/16W 0402; Tolerance: 1%; Size: 0402; ComponentLink1Description: Datasheet; ComponentLink1URL: https://www.yageo.com/upload/media/product/products/datasheet/rchip/PYu-RC_Group_51_RoHS_L_12.pdf
U10 = IC-CAN-0001: IC TRANSCEIVER 1/1 8SOIC; ComponentLink1Description: Datasheet; ComponentLink1URL: https://www.ti.com/lit/ds/symlink/tcan1044-q1.pdf?HQS=dis-dk-null-digikeymode-dsf-pf-null-wwe&ts=1728758303289&ref_url=https%253A%252F%252Fwww.ti.com%252Fgeneral%252Fdocs%252Fsuppproductinfo.tsp%253FdistId%253D10%2526gotoUrl%253Dhttps%253A%252F%252Fwww.ti.com%252Flit%252Fgpn%252Ftcan1044-q1

## Sheet Thermal_Sens.SchDoc
size 259 x 167 mm; SheetNumber: 13; SheetTotal: 15
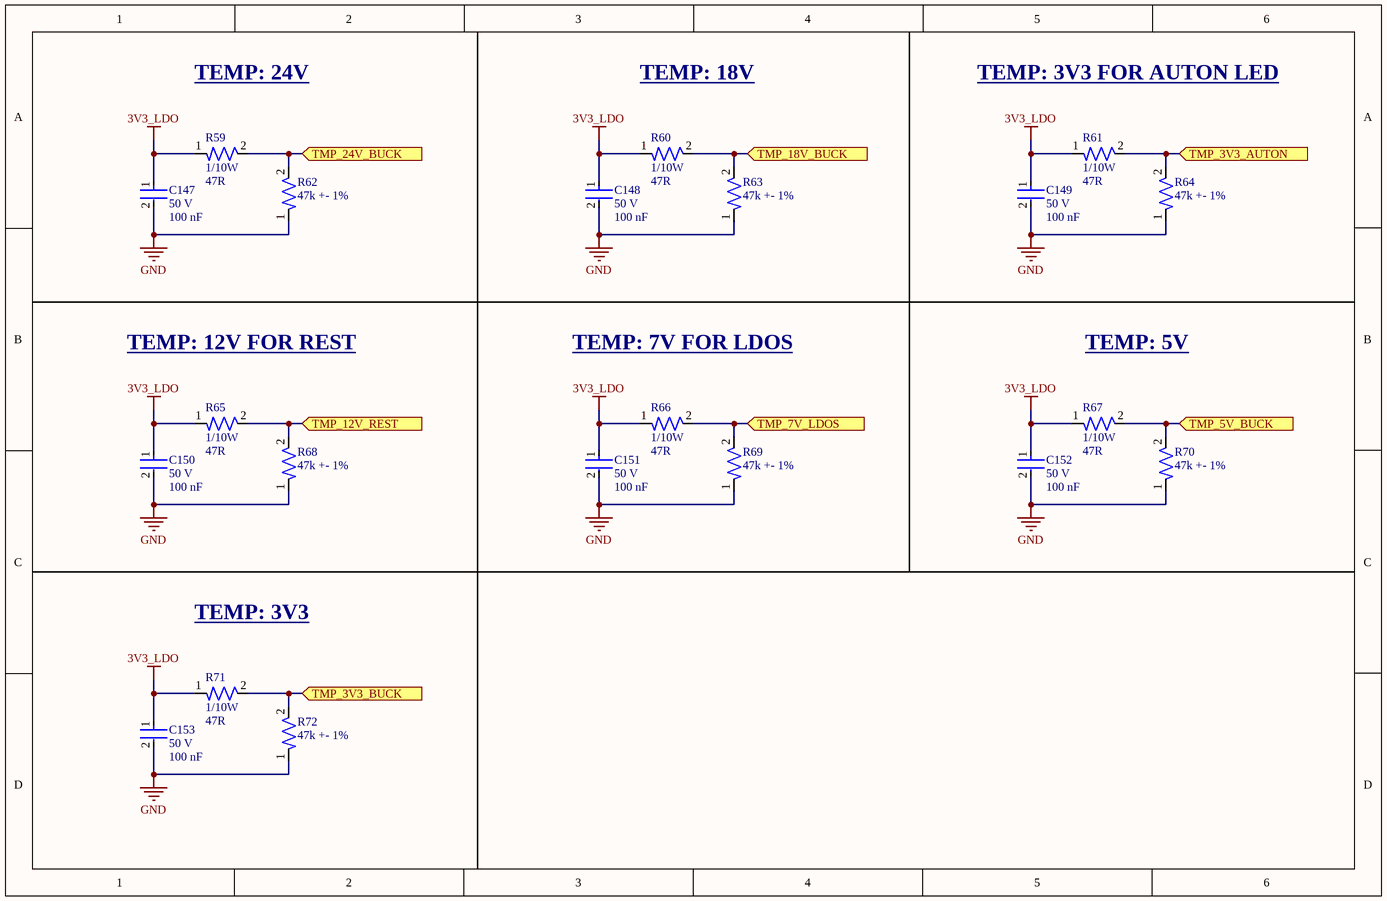
[diagram p11: Thermal_Sens.SchDoc]

### Parts
C147  Voltage Rating: 50 V  Capacitance: 100 nF  [CAP-0805]  (hidden comment: CC0805KRX7R9BB104)
C148  Voltage Rating: 50 V  Capacitance: 100 nF  [CAP-0805]  (hidden comment: CC0805KRX7R9BB104)
C149  Voltage Rating: 50 V  Capacitance: 100 nF  [CAP-0805]  (hidden comment: CC0805KRX7R9BB104)
C150  Voltage Rating: 50 V  Capacitance: 100 nF  [CAP-0805]  (hidden comment: CC0805KRX7R9BB104)
C151  Voltage Rating: 50 V  Capacitance: 100 nF  [CAP-0805]  (hidden comment: CC0805KRX7R9BB104)
C152  Voltage Rating: 50 V  Capacitance: 100 nF  [CAP-0805]  (hidden comment: CC0805KRX7R9BB104)
C153  Voltage Rating: 50 V  Capacitance: 100 nF  [CAP-0805]  (hidden comment: CC0805KRX7R9BB104)
R59  Power: 1/10W  Resistance: 47R  [RES-0603]  (hidden comment: RC0603FR-0747RL)
R60  Power: 1/10W  Resistance: 47R  [RES-0603]  (hidden comment: RC0603FR-0747RL)
R61  Power: 1/10W  Resistance: 47R  [RES-0603]  (hidden comment: RC0603FR-0747RL)
R62  Resistance: 47k +- 1%  [RES-0402]  (hidden comment: TMP6431DECR)
R63  Resistance: 47k +- 1%  [RES-0402]  (hidden comment: TMP6431DECR)
R64  Resistance: 47k +- 1%  [RES-0402]  (hidden comment: TMP6431DECR)
R65  Power: 1/10W  Resistance: 47R  [RES-0603]  (hidden comment: RC0603FR-0747RL)
R66  Power: 1/10W  Resistance: 47R  [RES-0603]  (hidden comment: RC0603FR-0747RL)
R67  Power: 1/10W  Resistance: 47R  [RES-0603]  (hidden comment: RC0603FR-0747RL)
R68  Resistance: 47k +- 1%  [RES-0402]  (hidden comment: TMP6431DECR)
R69  Resistance: 47k +- 1%  [RES-0402]  (hidden comment: TMP6431DECR)
R70  Resistance: 47k +- 1%  [RES-0402]  (hidden comment: TMP6431DECR)
R71  Power: 1/10W  Resistance: 47R  [RES-0603]  (hidden comment: RC0603FR-0747RL)
R72  Resistance: 47k +- 1%  [RES-0402]  (hidden comment: TMP6431DECR)

### Ports
TMP_3V3_AUTON (in), TMP_3V3_BUCK (in), TMP_5V_BUCK (in), TMP_7V_LDOS (in), TMP_12V_REST (in), TMP_18V_BUCK (in), TMP_24V_BUCK (in)

### Nets
3V3_LDO: C147.1 C148.1 C149.1 C150.1 C151.1 C152.1 C153.1 R59.1 R60.1 R61.1 R65.1 R66.1 R67.1 R71.1
GND: C147.2 C148.2 C149.2 C150.2 C151.2 C152.2 C153.2 R62.1 R63.1 R64.1 R68.1 R69.1 R70.1 R72.1
NetR59_2: R59.2 R62.2 ; port TMP_24V_BUCK
NetR60_2: R60.2 R63.2 ; port TMP_18V_BUCK
NetR61_2: R61.2 R64.2 ; port TMP_3V3_AUTON
NetR65_2: R65.2 R68.2 ; port TMP_12V_REST
NetR66_2: R66.2 R69.2 ; port TMP_7V_LDOS
NetR67_2: R67.2 R70.2 ; port TMP_5V_BUCK
NetR71_2: R71.2 R72.2 ; port TMP_3V3_BUCK

### Notes on the sheet
- TEMP: 24V
- TEMP: 18V
- TEMP: 3V3 FOR AUTON LED
- TEMP: 12V FOR REST
- TEMP: 7V FOR LDOS
- TEMP: 5V
- TEMP: 3V3

### Library data of the parts
C147-C153 = CAP-0.1U-0002: CAP CER 0.1UF 50V X7R 0805; ComponentLink2Description: Datasheet; ComponentLink2URL: https://www.yageo.com/upload/media/product/productsearch/datasheet/mlcc/UPY-GPHC_X7R_6.3V-to-250V_24.pdf; Device Class: Ceramic; Size: 0805
R59-R61 R65-R67 R71 = RES-47-0001: RES 47 OHM 1% 1/10W 0603; Tolerance: 1%; Size: 0603; ComponentLink1Description: Datasheet; ComponentLink1URL: https://www.yageo.com/upload/media/product/products/datasheet/rchip/PYu-RC_Group_51_RoHS_L_12.pdf
R62-R64 R68-R70 R72 = RES-47k-0001: PTC Thermistor 47 kOhms 0402 (1006 Metric)

## Sheet Current_Sens.SchDoc
size 259 x 167 mm; SheetNumber: 14; SheetTotal: 15
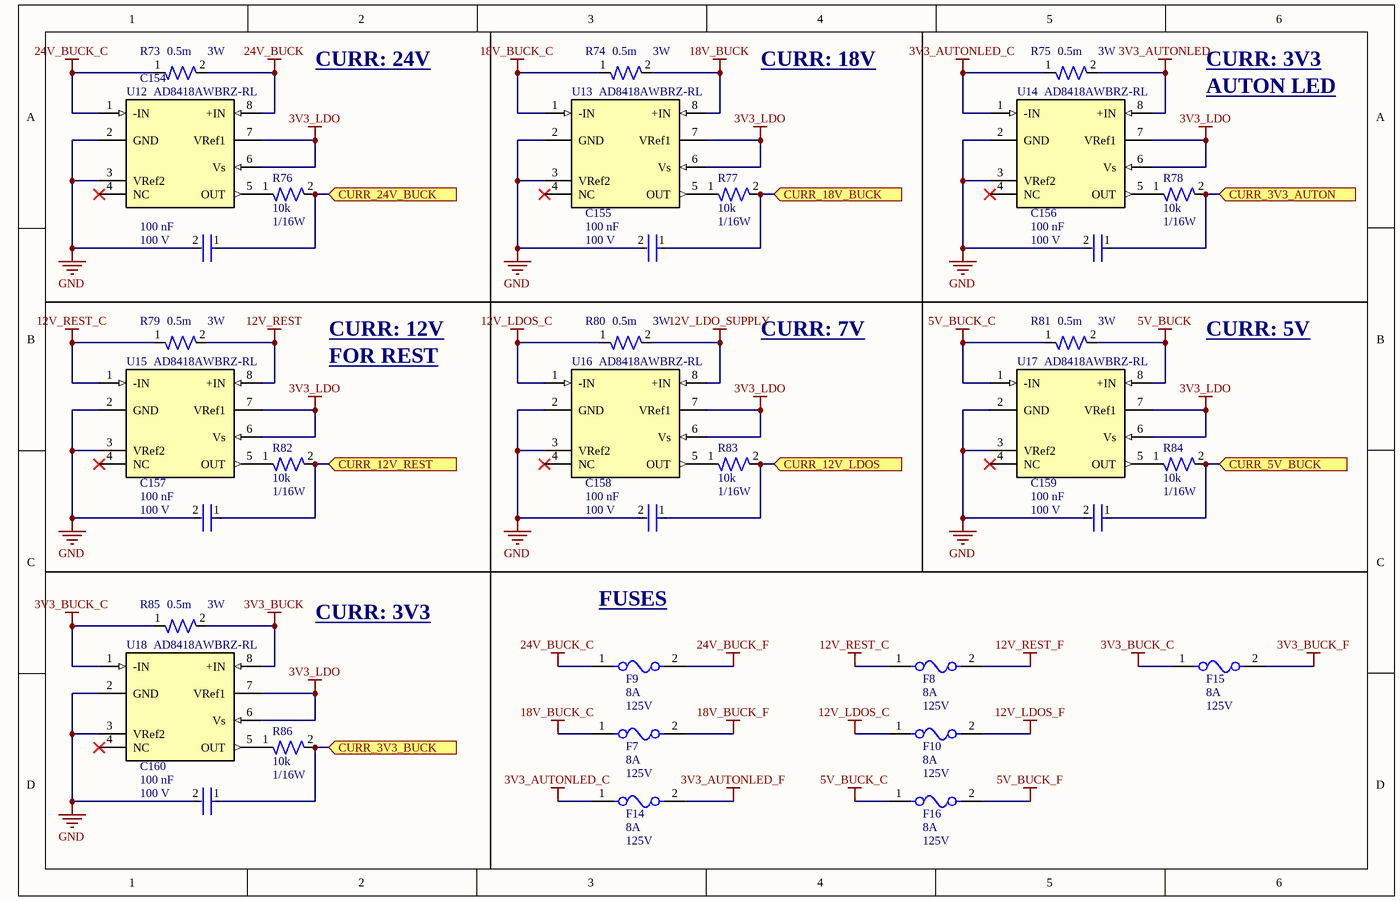
[diagram p12: Current_Sens.SchDoc]

### Parts
(Parts that share a designator on the sheet are numbered #1, #2 ... from top to bottom, then left to right.)
C154  Capacitance: 100 nF  Voltage: 100 V  [CAP-0603]  (hidden comment: CC0603KRX7R0BB104)
C155  Capacitance: 100 nF  Voltage: 100 V  [CAP-0603]  (hidden comment: CC0603KRX7R0BB104)
C156  Capacitance: 100 nF  Voltage: 100 V  [CAP-0603]  (hidden comment: CC0603KRX7R0BB104)
C157  Capacitance: 100 nF  Voltage: 100 V  [CAP-0603]  (hidden comment: CC0603KRX7R0BB104)
C158  Capacitance: 100 nF  Voltage: 100 V  [CAP-0603]  (hidden comment: CC0603KRX7R0BB104)
C159  Capacitance: 100 nF  Voltage: 100 V  [CAP-0603]  (hidden comment: CC0603KRX7R0BB104)
C160  Capacitance: 100 nF  Voltage: 100 V  [CAP-0603]  (hidden comment: CC0603KRX7R0BB104)
F7  Fuse Current: 8A  Voltage Rating: 125V  [FUSE-0001]  (hidden comment: 01550900M)
F8#2  Fuse Current: 8A  Voltage Rating: 125V  [FUSE-0001]  (hidden comment: 01550900M)
F9  Fuse Current: 8A  Voltage Rating: 125V  [FUSE-0001]  (hidden comment: 01550900M)
F10  Fuse Current: 8A  Voltage Rating: 125V  [FUSE-0001]  (hidden comment: 01550900M)
F14  Fuse Current: 8A  Voltage Rating: 125V  [FUSE-0001]  (hidden comment: 01550900M)
F15  Fuse Current: 8A  Voltage Rating: 125V  [FUSE-0001]  (hidden comment: 01550900M)
F16  Fuse Current: 8A  Voltage Rating: 125V  [FUSE-0001]  (hidden comment: 01550900M)
R73  Power: 3W  Resistance: 0.5m  [RES-2512]  (hidden comment: CSNL2512FTL500)
R74  Power: 3W  Resistance: 0.5m  [RES-2512]  (hidden comment: CSNL2512FTL500)
R75  Power: 3W  Resistance: 0.5m  [RES-2512]  (hidden comment: CSNL2512FTL500)
R76  Resistance: 10k  Power: 1/16W  [RES-0402]  (hidden comment: RC0402FR-0710KL)
R77  Resistance: 10k  Power: 1/16W  [RES-0402]  (hidden comment: RC0402FR-0710KL)
R78  Resistance: 10k  Power: 1/16W  [RES-0402]  (hidden comment: RC0402FR-0710KL)
R79  Power: 3W  Resistance: 0.5m  [RES-2512]  (hidden comment: CSNL2512FTL500)
R80  Power: 3W  Resistance: 0.5m  [RES-2512]  (hidden comment: CSNL2512FTL500)
R81  Power: 3W  Resistance: 0.5m  [RES-2512]  (hidden comment: CSNL2512FTL500)
R82  Resistance: 10k  Power: 1/16W  [RES-0402]  (hidden comment: RC0402FR-0710KL)
R83  Resistance: 10k  Power: 1/16W  [RES-0402]  (hidden comment: RC0402FR-0710KL)
R84  Resistance: 10k  Power: 1/16W  [RES-0402]  (hidden comment: RC0402FR-0710KL)
R85  Power: 3W  Resistance: 0.5m  [RES-2512]  (hidden comment: CSNL2512FTL500)
R86  Resistance: 10k  Power: 1/16W  [RES-0402]  (hidden comment: RC0402FR-0710KL)
U12  AD8418AWBRZ-RL  [IC-CURR]
U13  AD8418AWBRZ-RL  [IC-CURR]
U14  AD8418AWBRZ-RL  [IC-CURR]
U15  AD8418AWBRZ-RL  [IC-CURR]
U16  AD8418AWBRZ-RL  [IC-CURR]
U17  AD8418AWBRZ-RL  [IC-CURR]
U18  AD8418AWBRZ-RL  [IC-CURR]

### Ports
CURR_3V3_AUTON (in), CURR_3V3_BUCK (in, see MCU[4D]), CURR_5V_BUCK (in, see MCU[4D]), CURR_12V_LDOS (in), CURR_12V_REST (in), CURR_18V_BUCK (in, see MCU[4C]), CURR_24V_BUCK (in, see MCU[4C])

### Nets
3V3_AUTONLED: R75.2 U14.8(+IN)
3V3_AUTONLED_C: F14.1 R75.1 U14.1(-IN)
3V3_AUTONLED_F: F14.2
3V3_BUCK: R85.2 U18.8(+IN)
3V3_BUCK_C: F15.1 R85.1 U18.1(-IN)
3V3_BUCK_F: F15.2
3V3_LDO: U12.6(Vs) U12.7(VRef1) U13.6(Vs) U13.7(VRef1) U14.6(Vs) U14.7(VRef1) U15.6(Vs) U15.7(VRef1) U16.6(Vs) U16.7(VRef1) U17.6(Vs) U17.7(VRef1) U18.6(Vs) U18.7(VRef1)
5V_BUCK: R81.2 U17.8(+IN)
5V_BUCK_C: F16.1 R81.1 U17.1(-IN)
5V_BUCK_F: F16.2
12V_LDO_SUPPLY: R80.2 U16.8(+IN)
12V_LDOS_C: F10.1 R80.1 U16.1(-IN)
12V_LDOS_F: F10.2
12V_REST: R79.2 U15.8(+IN)
12V_REST_C: F8#2.1 R79.1 U15.1(-IN)
12V_REST_F: F8#2.2
18V_BUCK: R74.2 U13.8(+IN)
18V_BUCK_C: F7.1 R74.1 U13.1(-IN)
18V_BUCK_F: F7.2
24V_BUCK: R73.2 U12.8(+IN)
24V_BUCK_C: F9.1 R73.1 U12.1(-IN)
24V_BUCK_F: F9.2
GND: C154.2 C155.2 C156.2 C157.2 C158.2 C159.2 C160.2 U12.2(GND) U12.3(VRef2) U13.2(GND) U13.3(VRef2) U14.2(GND) U14.3(VRef2) U15.2(GND) U15.3(VRef2) U16.2(GND) U16.3(VRef2) U17.2(GND) U17.3(VRef2) U18.2(GND) U18.3(VRef2)
NetC154_1: C154.1 R76.2 ; port CURR_24V_BUCK
NetC155_1: C155.1 R77.2 ; port CURR_18V_BUCK
NetC156_1: C156.1 R78.2 ; port CURR_3V3_AUTON
NetC157_1: C157.1 R82.2 ; port CURR_12V_REST
NetC158_1: C158.1 R83.2 ; port CURR_12V_LDOS
NetC159_1: C159.1 R84.2 ; port CURR_5V_BUCK
NetC160_1: C160.1 R86.2 ; port CURR_3V3_BUCK
NetR76_1: R76.1 U12.5(OUT)
NetR77_1: R77.1 U13.5(OUT)
NetR78_1: R78.1 U14.5(OUT)
NetR82_1: R82.1 U15.5(OUT)
NetR83_1: R83.1 U16.5(OUT)
NetR84_1: R84.1 U17.5(OUT)
NetR86_1: R86.1 U18.5(OUT)

Not connected (* = marked no-connect by the designer): U12 4(NC)*; U13 4(NC)*; U14 4(NC)*; U15 4(NC)*; U16 4(NC)*; U17 4(NC)*; U18 4(NC)*

### Notes on the sheet
- CURR: 24V
- CURR: 18V
- CURR: 3V3
- AUTON LED
- CURR: 12V
- FOR REST
- CURR: 7V
- CURR: 5V
- FUSES

### Library data of the parts
C154-C160 = CAP-100N-0001: CAP CER 0.1UF 100V X7R 0603; Device Class: Ceramic; Size: 0603; ComponentLink1Description: Datasheet; ComponentLink1URL: https://www.yageo.com/upload/media/product/app/datasheet/mlcc/upy-np0x7r_mv_100-to-630v.pdf
F7 F8#2 F9 F10 F14-F16 = FUSE-0001: FUSE BLOK CARTRIDGE 125V 10A SMD; ComponentLink2Description: Datasheet; ComponentLink2URL: https://www.littelfuse.com/~/media/electronics/datasheets/fuses/littelfuse_fuse_154_154t_154l_154tl_datasheet.pdf.pdf
R73-R75 R79-R81 R85 = RES-0.5m-0001: 2512 Chip Resistor - Surface Mount ROHS; Tolerance: 1%; Size: 0402; ComponentLink1Description: Datasheet; ComponentLink1URL: https://www.yageo.com/upload/media/product/products/datasheet/rchip/PYu-RC_Group_51_RoHS_L_12.pdf
R76-R78 R82-R84 R86 = RES-10k-0001: RES 10K OHM 1% 1/16W 0402; Tolerance: 1%; Size: 0402; ComponentLink1Description: Datasheet; ComponentLink1URL: https://www.yageo.com/upload/media/product/products/datasheet/rchip/PYu-RC_Group_51_RoHS_L_12.pdf
U12-U18 = IC-CURR-0001: Current Sense Amplifier 1 Circuit 8-MSOP